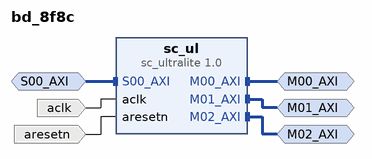
[diagram p0: block diagram of the top level]
# Vivado block design bd_8f8c, xc7s25csga324-1, Vivado 2026.1
create_bd_design bd_8f8c

create_bd_intf_port -mode Slave -vlnv xilinx.com:interface:aximm_rtl:1.0 S00_AXI
create_bd_intf_port -mode Master -vlnv xilinx.com:interface:aximm_rtl:1.0 M00_AXI
create_bd_intf_port -mode Master -vlnv xilinx.com:interface:aximm_rtl:1.0 M01_AXI
create_bd_intf_port -mode Master -vlnv xilinx.com:interface:aximm_rtl:1.0 M02_AXI
create_bd_port -dir I -type clk aclk
set_property -dict {CONFIG.ASSOCIATED_BUSIF M00_AXI:M01_AXI:M02_AXI:S00_AXI} [get_bd_ports aclk]
create_bd_port -dir I -type rst aresetn

create_bd_cell -type ip -vlnv xilinx.com:ip:sc_ultralite:1.0 sc_ul
set_property -dict [list \
  CONFIG.IS_SMARTCONNECT true \
  CONFIG.M00_ACLK_RELATIONSHIP 1 \
  CONFIG.M00_AXI_ADDR_WIDTH 9 \
  CONFIG.M00_AXI_ARUSER_WIDTH 0 \
  CONFIG.M00_AXI_AWUSER_WIDTH 0 \
  CONFIG.M00_AXI_BUSER_WIDTH 0 \
  CONFIG.M00_AXI_DATA_WIDTH 32 \
  CONFIG.M00_AXI_PROTOCOL AXI4LITE \
  CONFIG.M00_AXI_RUSER_BITS_PER_BYTE 0 \
  CONFIG.M00_AXI_WUSER_BITS_PER_BYTE 0 \
  CONFIG.M00_SUPPORTS_READ true \
  CONFIG.M00_SUPPORTS_WRITE true \
  CONFIG.M01_ACLK_RELATIONSHIP 1 \
  CONFIG.M01_AXI_ADDR_WIDTH 7 \
  CONFIG.M01_AXI_ARUSER_WIDTH 0 \
  CONFIG.M01_AXI_AWUSER_WIDTH 0 \
  CONFIG.M01_AXI_BUSER_WIDTH 0 \
  CONFIG.M01_AXI_DATA_WIDTH 32 \
  CONFIG.M01_AXI_PROTOCOL AXI4LITE \
  CONFIG.M01_AXI_RUSER_BITS_PER_BYTE 0 \
  CONFIG.M01_AXI_WUSER_BITS_PER_BYTE 0 \
  CONFIG.M01_SUPPORTS_READ true \
  CONFIG.M01_SUPPORTS_WRITE true \
  CONFIG.M02_ACLK_RELATIONSHIP 1 \
  CONFIG.M02_AXI_ADDR_WIDTH 4 \
  CONFIG.M02_AXI_ARUSER_WIDTH 0 \
  CONFIG.M02_AXI_AWUSER_WIDTH 0 \
  CONFIG.M02_AXI_BUSER_WIDTH 0 \
  CONFIG.M02_AXI_DATA_WIDTH 32 \
  CONFIG.M02_AXI_PROTOCOL AXI4LITE \
  CONFIG.M02_AXI_RUSER_BITS_PER_BYTE 0 \
  CONFIG.M02_AXI_WUSER_BITS_PER_BYTE 0 \
  CONFIG.M02_SUPPORTS_READ true \
  CONFIG.M02_SUPPORTS_WRITE true \
  CONFIG.NUM_MI 3 \
  CONFIG.NUM_SEG 3 \
  CONFIG.NUM_SI 1 \
  CONFIG.S00_ACLK_RELATIONSHIP 1 \
  CONFIG.S00_AXI_ADDR_WIDTH 32 \
  CONFIG.S00_AXI_ARUSER_WIDTH 0 \
  CONFIG.S00_AXI_AWUSER_WIDTH 0 \
  CONFIG.S00_AXI_BUSER_WIDTH 0 \
  CONFIG.S00_AXI_DATA_WIDTH 32 \
  CONFIG.S00_AXI_ID_WIDTH 0 \
  CONFIG.S00_AXI_PROTOCOL AXI4LITE \
  CONFIG.S00_AXI_RUSER_BITS_PER_BYTE 0 \
  CONFIG.S00_AXI_WUSER_BITS_PER_BYTE 0 \
  CONFIG.S00_SUPPORTS_NARROW false \
  CONFIG.S00_SUPPORTS_READ true \
  CONFIG.S00_SUPPORTS_WRITE true \
  CONFIG.SEG00_BASE_ADDR 0x0000000040000000 \
  CONFIG.SEG00_MI 0 \
  CONFIG.SEG00_RANGE 16 \
  CONFIG.SEG00_SECURE_READ False \
  CONFIG.SEG00_SECURE_WRITE False \
  CONFIG.SEG00_SUPPORTS_READ true \
  CONFIG.SEG00_SUPPORTS_WRITE true \
  CONFIG.SEG01_BASE_ADDR 0x0000000040600000 \
  CONFIG.SEG01_MI 2 \
  CONFIG.SEG01_RANGE 16 \
  CONFIG.SEG01_SECURE_READ False \
  CONFIG.SEG01_SECURE_WRITE False \
  CONFIG.SEG01_SUPPORTS_READ true \
  CONFIG.SEG01_SUPPORTS_WRITE true \
  CONFIG.SEG02_BASE_ADDR 0x0000000044A00000 \
  CONFIG.SEG02_MI 1 \
  CONFIG.SEG02_RANGE 16 \
  CONFIG.SEG02_SECURE_READ False \
  CONFIG.SEG02_SECURE_WRITE False \
  CONFIG.SEG02_SUPPORTS_READ true \
  CONFIG.SEG02_SUPPORTS_WRITE true \
] [get_bd_cells sc_ul]

# ---- connections ----

connect_bd_intf_net [get_bd_intf_ports S00_AXI] [get_bd_intf_pins sc_ul/S00_AXI]
connect_bd_intf_net [get_bd_intf_ports M00_AXI] [get_bd_intf_pins sc_ul/M00_AXI]
connect_bd_intf_net [get_bd_intf_ports M01_AXI] [get_bd_intf_pins sc_ul/M01_AXI]
connect_bd_intf_net [get_bd_intf_ports M02_AXI] [get_bd_intf_pins sc_ul/M02_AXI]
connect_bd_net -net aclk_net [get_bd_ports aclk] [get_bd_pins sc_ul/aclk]
connect_bd_net [get_bd_ports aresetn] [get_bd_pins sc_ul/aresetn]

validate_bd_design
save_bd_design
